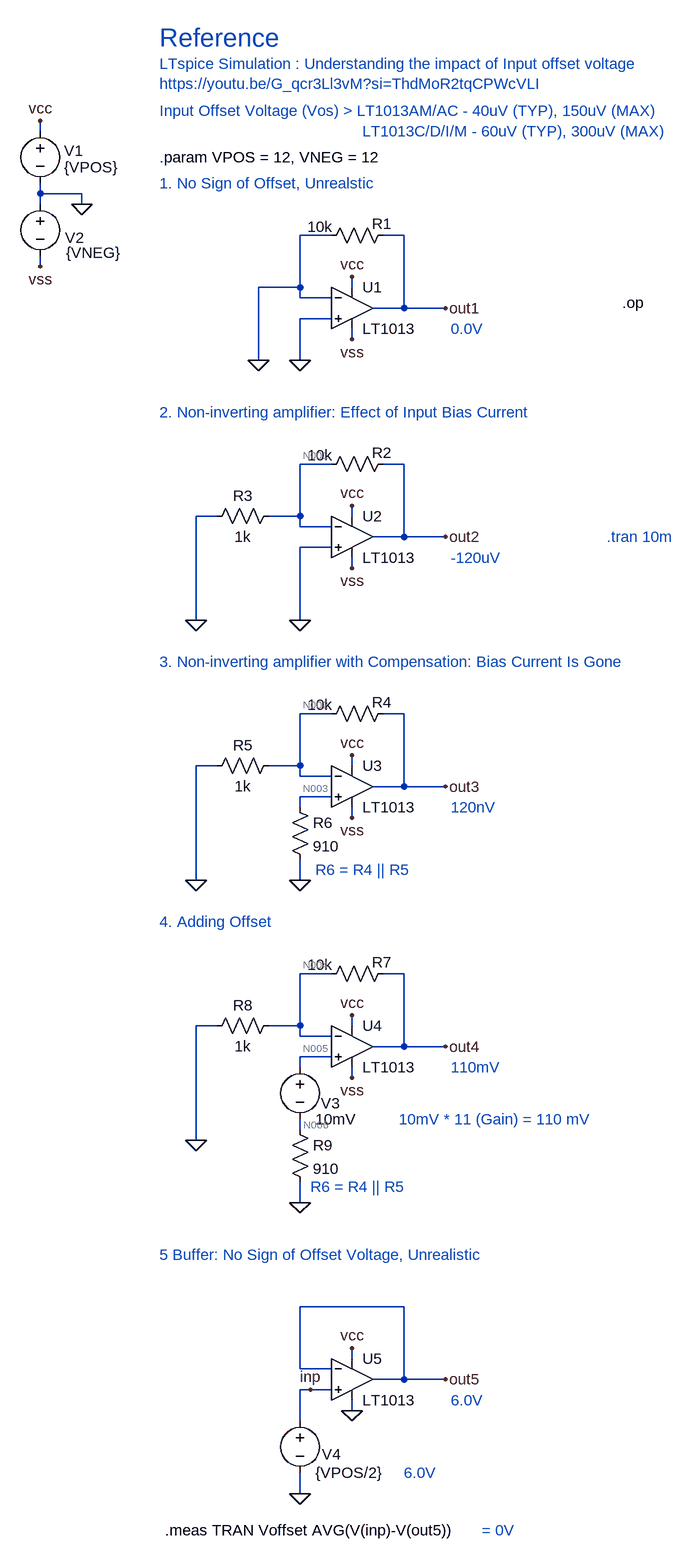
[diagram p0: schematic 01-lt1013_offset_voltage.asc]
01-lt1013_offset_voltage.asc, the LTspice schematic file:
Version 4
SHEET 1 1236 2280
WIRE -256 112 -256 96
WIRE -256 208 -256 192
WIRE -192 208 -256 208
WIRE -256 224 -256 208
WIRE -192 224 -192 208
WIRE 192 272 144 272
WIRE 304 272 272 272
WIRE -256 320 -256 304
WIRE 144 352 144 272
WIRE 144 352 80 352
WIRE 224 352 224 336
WIRE 144 368 144 352
WIRE 192 368 144 368
WIRE 304 384 304 272
WIRE 304 384 256 384
WIRE 368 384 304 384
WIRE 192 400 144 400
WIRE 224 432 224 416
WIRE 80 464 80 352
WIRE 144 464 144 400
WIRE 192 624 144 624
WIRE 304 624 272 624
WIRE 16 704 -16 704
WIRE 144 704 144 624
WIRE 144 704 96 704
WIRE 224 704 224 688
WIRE 144 720 144 704
WIRE 192 720 144 720
WIRE 304 736 304 624
WIRE 304 736 256 736
WIRE 368 736 304 736
WIRE 192 752 144 752
WIRE 224 784 224 768
WIRE -16 864 -16 704
WIRE 144 864 144 752
WIRE 192 1008 144 1008
WIRE 304 1008 272 1008
WIRE 16 1088 -16 1088
WIRE 144 1088 144 1008
WIRE 144 1088 96 1088
WIRE 224 1088 224 1072
WIRE 144 1104 144 1088
WIRE 192 1104 144 1104
WIRE 304 1120 304 1008
WIRE 304 1120 256 1120
WIRE 368 1120 304 1120
WIRE 192 1136 144 1136
WIRE 144 1152 144 1136
WIRE 224 1168 224 1152
WIRE -16 1264 -16 1088
WIRE 144 1264 144 1232
WIRE 192 1408 144 1408
WIRE 304 1408 272 1408
WIRE 16 1488 -16 1488
WIRE 144 1488 144 1408
WIRE 144 1488 96 1488
WIRE 224 1488 224 1472
WIRE 144 1504 144 1488
WIRE 192 1504 144 1504
WIRE 304 1520 304 1408
WIRE 304 1520 256 1520
WIRE 368 1520 304 1520
WIRE 192 1536 144 1536
WIRE 144 1552 144 1536
WIRE 224 1568 224 1552
WIRE 144 1648 144 1632
WIRE -16 1664 -16 1488
WIRE 144 1760 144 1728
WIRE 304 1920 144 1920
WIRE 224 2000 224 1984
WIRE 144 2016 144 1920
WIRE 192 2016 144 2016
WIRE 304 2032 304 1920
WIRE 304 2032 256 2032
WIRE 368 2032 304 2032
WIRE 160 2048 144 2048
WIRE 192 2048 160 2048
WIRE 224 2080 224 2064
WIRE 144 2096 144 2048
WIRE 144 2208 144 2176
FLAG -192 224 0
FLAG -256 96 vcc
FLAG -256 320 vss
FLAG 224 336 vcc
FLAG 224 432 vss
FLAG 144 464 0
FLAG 368 384 out1
FLAG 80 464 0
FLAG 224 688 vcc
FLAG 224 784 vss
FLAG 144 864 0
FLAG 368 736 out2
FLAG -16 864 0
FLAG 224 1072 vcc
FLAG 224 1168 vss
FLAG 144 1264 0
FLAG 368 1120 out3
FLAG -16 1264 0
FLAG 224 1472 vcc
FLAG 224 1568 vss
FLAG 144 1760 0
FLAG 368 1520 out4
FLAG -16 1664 0
FLAG 224 1984 vcc
FLAG 144 2208 0
FLAG 368 2032 out5
FLAG 224 2080 0
FLAG 160 2048 inp
DATAFLAG 304 1120 "$-V(vss)"
SYMBOL voltage -256 96 R0
WINDOW 0 37 46 Left 2
WINDOW 3 37 71 Left 2
SYMATTR InstName V1
SYMATTR Value {VPOS}
SYMBOL voltage -256 208 R0
WINDOW 0 38 68 Left 2
WINDOW 3 40 91 Left 2
SYMATTR InstName V2
SYMATTR Value {VNEG}
SYMBOL OpAmps\\LT1013 224 320 R0
SYMATTR InstName U1
SYMBOL res 288 256 R90
WINDOW 0 14 18 VBottom 2
WINDOW 3 -13 113 VTop 2
SYMATTR InstName R1
SYMATTR Value 10k
SYMBOL OpAmps\\LT1013 224 672 R0
SYMATTR InstName U2
SYMBOL res 288 608 R90
WINDOW 0 14 18 VBottom 2
WINDOW 3 -13 113 VTop 2
SYMATTR InstName R2
SYMATTR Value 10k
SYMBOL res 112 688 R90
WINDOW 0 0 56 VBottom 2
WINDOW 3 32 56 VTop 2
SYMATTR InstName R3
SYMATTR Value 1k
SYMBOL OpAmps\\LT1013 224 1056 R0
SYMATTR InstName U3
SYMBOL res 288 992 R90
WINDOW 0 14 18 VBottom 2
WINDOW 3 -13 113 VTop 2
SYMATTR InstName R4
SYMATTR Value 10k
SYMBOL res 112 1072 R90
WINDOW 0 0 56 VBottom 2
WINDOW 3 32 56 VTop 2
SYMATTR InstName R5
SYMATTR Value 1k
SYMBOL res 128 1136 R0
SYMATTR InstName R6
SYMATTR Value 910
SYMBOL OpAmps\\LT1013 224 1456 R0
SYMATTR InstName U4
SYMBOL res 288 1392 R90
WINDOW 0 14 18 VBottom 2
WINDOW 3 -13 113 VTop 2
SYMATTR InstName R7
SYMATTR Value 10k
SYMBOL res 112 1472 R90
WINDOW 0 0 56 VBottom 2
WINDOW 3 32 56 VTop 2
SYMATTR InstName R8
SYMATTR Value 1k
SYMBOL res 128 1632 R0
SYMATTR InstName R9
SYMATTR Value 910
SYMBOL voltage 144 1536 R0
WINDOW 0 32 71 Left 2
SYMATTR InstName V3
SYMATTR Value 10mV
SYMBOL OpAmps\\LT1013 224 1968 R0
SYMATTR InstName U5
SYMBOL voltage 144 2080 R0
WINDOW 0 34 67 Left 2
SYMATTR InstName V4
SYMATTR Value {VPOS/2}
TEXT -72 -32 Left 4 ;Reference
TEXT -72 8 Left 2 ;LTspice Simulation : Understanding the impact of Input offset voltage\nhttps://youtu.be/G_qcr3Ll3vM?si=ThdMoR2tqCPWcVLI
TEXT -72 192 Left 2 ;1. No Sign of Offset, Unrealstic
TEXT 616 736 Left 2 ;.tran 10m
TEXT -72 80 Left 2 ;Input Offset Voltage (Vos) > LT1013AM/AC - 40uV (TYP), 150uV (MAX)
TEXT 240 112 Left 2 ;LT1013C/D/I/M - 60uV (TYP), 300uV (MAX)
TEXT -72 544 Left 2 ;2. Non-inverting amplifier: Effect of Input Bias Current
TEXT 376 416 Left 2 ;0.0V
TEXT 376 768 Left 2 ;-120uV
TEXT 640 376 Left 2 !.op
TEXT -72 928 Left 2 ;3. Non-inverting amplifier with Compensation: Bias Current Is Gone
TEXT 376 1152 Left 2 ;120nV
TEXT 168 1248 Left 2 ;R6 = R4 || R5
TEXT -72 1328 Left 2 ;4. Adding Offset
TEXT 376 1552 Left 2 ;110mV
TEXT 160 1736 Left 2 ;R6 = R4 || R5
TEXT 296 1632 Left 2 ;10mV * 11 (Gain) = 110 mV
TEXT -72 1840 Left 2 ;5 Buffer: No Sign of Offset Voltage, Unrealistic
TEXT 376 2064 Left 2 ;6.0V
TEXT -72 152 Left 2 !.param VPOS = 12, VNEG = 12
TEXT -64 2264 Left 2 !.meas TRAN Voffset AVG(V(inp)-V(out5))
TEXT 424 2264 Left 2 ;= 0V
TEXT 304 2176 Left 2 ;6.0V

The netlist it stands for:
* 01-lt1013_offset_voltage.asc
V1 vcc 0 {VPOS}
V2 0 vss {VNEG}
XU1 0 0 vcc vss out1 LT1013  ; pins In+ In- V+ V- OUT
R1 out1 0 10k
XU2 0 N001 vcc vss out2 LT1013  ; pins In+ In- V+ V- OUT
R2 out2 N001 10k
R3 N001 0 1k
XU3 N003 N002 vcc vss out3 LT1013  ; pins In+ In- V+ V- OUT
R4 out3 N002 10k
R5 N002 0 1k
R6 N003 0 910
XU4 N005 N004 vcc vss out4 LT1013  ; pins In+ In- V+ V- OUT
R7 out4 N004 10k
R8 N004 0 1k
R9 N006 0 910
V3 N005 N006 10mV
XU5 inp out5 vcc 0 out5 LT1013  ; pins In+ In- V+ V- OUT
V4 inp 0 {VPOS/2}
* Reference
* LTspice Simulation : Understanding the impact of Input offset voltage
* https://youtu.be/G_qcr3Ll3vM?si=ThdMoR2tqCPWcVLI
* 1. No Sign of Offset, Unrealstic
* .tran 10m
* Input Offset Voltage (Vos) > LT1013AM/AC - 40uV (TYP), 150uV (MAX)
* LT1013C/D/I/M - 60uV (TYP), 300uV (MAX)
* 2. Non-inverting amplifier: Effect of Input Bias Current
* 0.0V
* -120uV
.op
* 3. Non-inverting amplifier with Compensation: Bias Current Is Gone
* 120nV
* R6 = R4 || R5
* 4. Adding Offset
* 110mV
* R6 = R4 || R5
* 10mV * 11 (Gain) = 110 mV
* 5 Buffer: No Sign of Offset Voltage, Unrealistic
* 6.0V
.param VPOS = 12, VNEG = 12
.meas TRAN Voffset AVG(V(inp)-V(out5))
* = 0V
* 6.0V
.lib LTC.lib
.backanno
.end

* Results of the author's LTspice run, read from the files saved beside the schematic
* Operating Point:
*   V(vcc) = 12 V
*   V(vss) = -12 V
*   V(out1) = 0 V
*   V(n001) = 15.86 pV
*   V(out2) = -120 µV
*   V(n002) = 10.92 µV
*   V(n003) = 10.92 µV
*   V(out3) = 120 nV
*   V(n004) = 10.01 mV
*   V(n005) = 10.01 mV
*   V(out4) = 110 mV
*   V(n006) = 10.92 µV
*   V(out5) = 6 V
*   V(inp) = 6 V
*   I(R1) = 0 A
*   I(R2) = -12 nA
*   I(R3) = 15.86 fA
*   I(R4) = -1.08 nA
*   I(R5) = 10.92 nA
*   I(R6) = 12 nA
*   I(R7) = 9.999 µA
*   I(R8) = 10.01 µA
*   I(R9) = 12 nA
*   I(V1) = -1.755 mA
*   I(V2) = -1.395 mA
*   I(V3) = 12 nA
*   I(V4) = 12 nA
* From the log:
*   Semiconductor Device Operating Points:
*                           --- Diodes ---
*   Name:    d:u1:1      d:u1:4      d:u1:5      d:u1:6      d:u1:2
*   Model:    u1:xu       u1:xd       u1:yu       u1:yd     u1:dbias
*   Id:     -1.20e-10   -1.20e-10    0.00e+00    0.00e+00   -1.20e-08
*   Vd:     -1.20e+01   -1.20e+01    0.00e+00    0.00e+00   -1.20e+01
*   Req:     1.00e-11    1.00e-11    1.00e-12    1.00e-12    1.00e-03
*   CAP:     0.00e+00    0.00e+00    0.00e+00    0.00e+00    0.00e+00
*   Name:    d:u1:3      d:u2:1      d:u2:4      d:u2:5      d:u2:6
*   Model:  u1:dbias      u2:xu       u2:xd       u2:yu       u2:yd
*   Id:     -1.20e-08   -1.20e-10   -1.20e-10   -8.58e-19    8.58e-19
*   Vd:     -1.20e+01   -1.20e+01   -1.20e+01   -8.57e-07    8.57e-07
*   Req:     1.00e-03    1.00e-11    1.00e-11    1.00e-12    1.00e-12
*   CAP:     0.00e+00    0.00e+00    0.00e+00    0.00e+00    0.00e+00
*   Name:    d:u2:2      d:u2:3      d:u3:1      d:u3:4      d:u3:5
*   Model:  u2:dbias    u2:dbias      u3:xu       u3:xd       u3:yu
*   Id:     -1.20e-08   -1.20e-08   -1.20e-10   -1.20e-10   -7.72e-20
*   Vd:     -1.20e+01   -1.20e+01   -1.20e+01   -1.20e+01   -7.71e-08
*   Req:     1.00e-03    1.00e-03    1.00e-11    1.00e-11    1.00e-12
*   CAP:     0.00e+00    0.00e+00    0.00e+00    0.00e+00    0.00e+00
*   Name:    d:u3:6      d:u3:2      d:u3:3      d:u4:1      d:u4:4
*   Model:    u3:yd     u3:dbias    u3:dbias      u4:xu       u4:xd
*   Id:      7.72e-20   -1.20e-08   -1.20e-08   -1.19e-10   -1.21e-10
*   Vd:      7.71e-08   -1.20e+01   -1.20e+01   -1.19e+01   -1.21e+01
*   Req:     1.00e-12    1.00e-03    1.00e-03    1.00e-11    1.00e-11
*   CAP:     0.00e+00    0.00e+00    0.00e+00    0.00e+00    0.00e+00
*   Name:    d:u4:5      d:u4:6      d:u4:2      d:u4:3      d:u5:1
*   Model:    u4:yu       u4:yd     u4:dbias    u4:dbias      u5:xu
*   Id:      7.15e-16   -7.15e-16   -1.20e-08   -1.20e-08   -6.00e-11
*   Vd:      7.14e-04   -7.14e-04   -1.20e+01   -1.20e+01   -6.00e+00
*   Req:     1.00e-12    1.00e-12    1.00e-03    1.00e-03    1.00e-11
*   CAP:     0.00e+00    0.00e+00    0.00e+00    0.00e+00    0.00e+00
*   Name:    d:u5:4      d:u5:5      d:u5:6      d:u5:2      d:u5:3
*   Model:    u5:xd       u5:yu       u5:yd     u5:dbias    u5:dbias
*   Id:     -6.00e-11   -8.58e-19    8.58e-19   -1.20e-08   -1.20e-08
*   Vd:     -6.00e+00   -8.57e-07    8.57e-07   -6.00e+00   -6.00e+00
*   Req:     1.00e-11    1.00e-12    1.00e-12    1.00e-03    1.00e-03
*   CAP:     0.00e+00    0.00e+00    0.00e+00    0.00e+00    0.00e+00
*                           --- VDMOSFET Transistors ---
*   Name:        m:u1:1      m:u1:2      m:u2:1      m:u2:2      m:u3:1
*   Model:        u1:n        u1:p        u2:n        u2:p        u3:n
*   Id:          3.50e-04   -3.50e-04    3.50e-04   -3.50e-04    3.50e-04
*   Vgs:         0.00e+00    0.00e+00   -8.57e-07   -8.57e-07   -7.71e-08
*   Vds:         1.20e+01   -1.20e+01    1.20e+01   -1.20e+01    1.20e+01
*   Vth:        -1.00e-01    1.00e-01   -1.00e-01    1.00e-01   -1.00e-01
*   Gm:          7.00e-03    7.00e-03    7.00e-03    7.00e-03    7.00e-03
*   Gds:         0.00e+00    0.00e+00    0.00e+00    0.00e+00    0.00e+00
*   Cgs:         0.00e+00    0.00e+00    0.00e+00    0.00e+00    0.00e+00
*   Cgd:         0.00e+00    0.00e+00    0.00e+00    0.00e+00    0.00e+00
*   Cbody:       0.00e+00    0.00e+00    0.00e+00    0.00e+00    0.00e+00
*   Name:        m:u3:2      m:u4:1      m:u4:2      m:u5:1      m:u5:2
*   Model:        u3:p        u4:n        u4:p        u5:n        u5:p
*   Id:         -3.50e-04    3.55e-04   -3.45e-04    3.50e-04   -3.50e-04
*   Vgs:        -7.71e-08    7.14e-04    7.14e-04   -8.57e-07   -8.57e-07
*   Vds:        -1.20e+01    1.19e+01   -1.21e+01    6.00e+00   -6.00e+00
*   Vth:         1.00e-01   -1.00e-01    1.00e-01   -1.00e-01    1.00e-01
*   Gm:          7.00e-03    7.05e-03    6.95e-03    7.00e-03    7.00e-03
*   Gds:         0.00e+00    0.00e+00    0.00e+00    0.00e+00    0.00e+00
*   Cgs:         0.00e+00    0.00e+00    0.00e+00    0.00e+00    0.00e+00
*   Cgd:         0.00e+00    0.00e+00    0.00e+00    0.00e+00    0.00e+00
*   Cbody:       0.00e+00    0.00e+00    0.00e+00    0.00e+00    0.00e+00